# Altium schematic sheet [06]IN_OUT.SchDoc
size A4
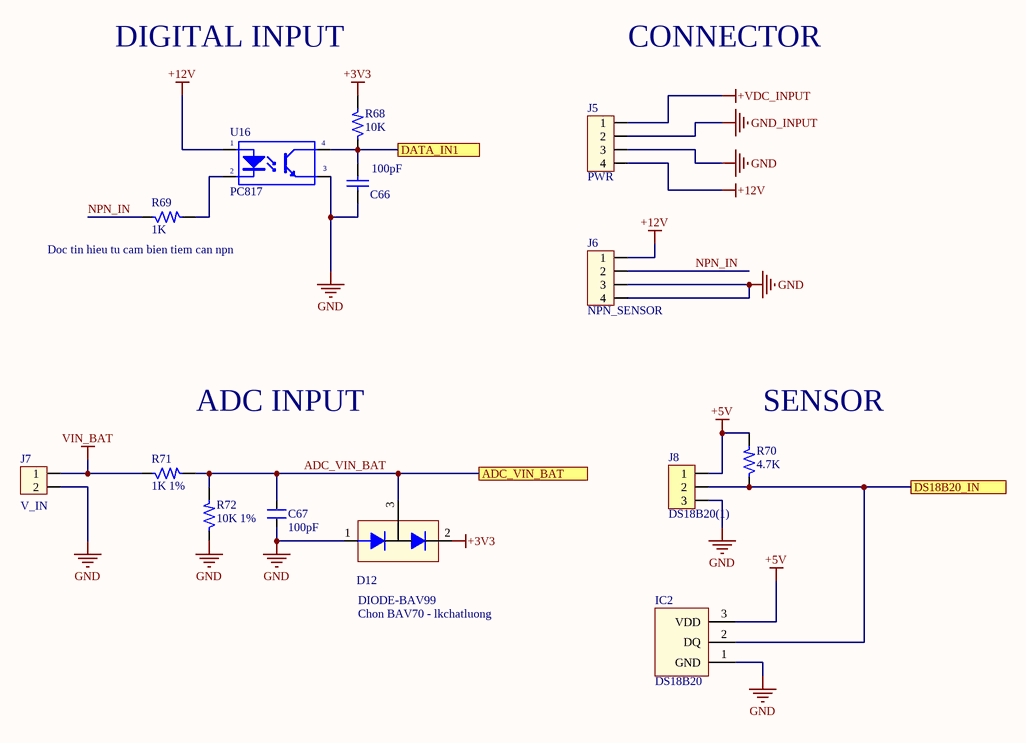
[diagram p0: [06]IN_OUT.SchDoc]

## Parts
C66  100pF  [CAP_0805]
C67  100pF  [CAP_0805]
D12  DIODE-BAV99  [SOT23]
IC2  DS18B20  [TO92]
J5  PWR  [Hed4V_3.96]
J6  NPN_SENSOR  [CON_2.54mm_4]
J7  V_IN  [CON_2.54mm_2]
J8  DS18B20(1)  [Header3]
R68  10K  [RES-SMD-0805]
R69  1K  [RES-SMD-0805]
R70  4.7K  [RES-SMD-0805]
R71  1K 1%  [RES-SMD-0805]
R72  10K 1%  [RES-SMD-0805]
U16  PC817  [PC817x1SMD]

## Ports
ADC_VIN_BAT, DATA_IN1, DS18B20_IN

## Nets
+3V3: D12.2 R68.2
+5V: IC2.3(VDD) J8.1 R70.2
+12V: J5.4 J6.1 U16.1(A)
+VDC_INPUT: J5.1
GND: C66.2 C67.1 D12.1 IC2.1(GND) J5.3 J6.3 J6.4 J7.2 J8.3 R72.1 U16.3(E)
GND_INPUT: J5.2
VIN_BAT: J7.1 R71.1
ADC_VIN_BAT: C67.2 D12.3 R71.2 R72.2 ; port ADC_VIN_BAT
DATA_IN1: C66.1 R68.1 U16.4(C) ; port DATA_IN1
DS18B20_IN: IC2.2(DQ) J8.2 R70.1 ; port DS18B20_IN
NPN_IN: J6.2 R69.1
NetR69_2: R69.2 U16.2(K)

## Notes on the sheet
- DIGITAL INPUT
- CONNECTOR
- (near R69) Doc tin hieu tu cam bien tiem can npn
- ADC INPUT
- (near R70) SENSOR
- Chon BAV70 - lkchatluong

## Library data of the parts
C66 = CapSMD: Capacitor; Value: 33p; Published: 8-Jun-2000; LatestRevisionDate: 17-Jul-2002; LatestRevisionNote: Re-released for DXP Platform.; PackageReference: RAD-0.3; Publisher: Altium Limited
C67 = CM: Cap SMD; Value: 103
D12 = DIODE-BAV99: ZENER, SOT23,; Manufacturer: ON Semiconductor / Fairchild; Manufacturer Part Number: BAV99; .Creator: LeKhaLinh; Other Drawings: Diode Circuit; PCN Design/Specification: Mold Compound 12/Dec/2007; PCN Assembly/Origin: SOT23 Manufacturing Source 31/May2013 / Assembly Site Addition 20/Jul/2015; PCN Packaging: Binary Year Code Marking 15/Jan/2014; Diode Configuration: 1 Pair Series Connection; Diode Type: Standard; Voltage - DC Reverse (Vr) (Max): 70V; Current - Average Rectified (Io) (per Diode): 200mA; Voltage - Forward (Vf) (Max) @ If: 1.25V @ 150mA; Speed: Small Signal =; Reverse Recovery Time (trr): 6ns; Current - Reverse Leakage @ Vr: 2.5µA @ 70V; Online Catalog: Diode Array; Other Names: BAV99FSDKR; .CheckPCB: LeKhaLinh; .CheckSCH: LeKhaLinh; Supplier 1: Digi-Key; Stock 1: 1165; Pricing 1: 1=0.26, 10=0.21, 100=0.1115, 500=0.0734, 1000=0.0499 (USD); Standard Package: 1; Category: Discrete Semiconductor Products; Family: Diodes, Rectifiers - Arrays; Packaging: Digi-Reel®; Mounting Type: Surface Mount; Package / Case: TO-236-3, SC-59, SOT-23-3; Supplier Device Package: SOT-23-3 (TO-236); ComponentLink1URL: https://www.fairchildsemi.com/package-drawings/MA/MA03B.pdf?src-supplier=Digi-Key; ComponentLink1Description: https://www.fairchildsemi.com/package-drawings/MA/MA03B.pdf?src-supplier=Digi-Key; ComponentLink2URL: http://www.farnell.com/datasheets/1822674.pdf?src-supplier=Element14; ComponentLink2Description: http://www.farnell.com/datasheets/1822674.pdf?src-supplier=Element14; ComponentLink3URL: http://www.mouser.com/ds/2/149/BAV99-22788.pdf?src-supplier=Mouser; ComponentLink3Description: http://www.mouser.com/ds/2/149/BAV99-22788.pdf?src-supplier=Mouser; ComponentLink4URL: http://www.fairchildsemi.com/ds/BA/BAV99.pdf?src-supplier=Avnet+Europe; ComponentLink4Description: http://www.fairchildsemi.com/ds/BA/BAV99.pdf?src-supplier=Avnet+Europe; ComponentLink5URL: https://www.verical.com/server-webapp/html/getDatasheet?partID=110217&src-supplier=Verical; ComponentLink5Description: https://www.verical.com/server-webapp/html/getDatasheet?partID=110217&src-supplier=Verical; ComponentLink6URL: http://www.farnell.com/datasheets/2304409.pdf?src-supplier=Element14; ComponentLink6Description: http://www.farnell.com/datasheets/2304409.pdf?src-supplier=Element14; Supplier 2: Mouser; Stock 2: 0; Supplier 3: Arrow; Stock 3: 5700; Pricing 3: 1=0.1933, 10=0.1873, 25=0.1555, 100=0.0806, 250=0.0724, 500=0.0523, 1000=0.0428, 3000=0.0342 (USD); Supplier Part Number 1: BAV99FSCT-ND; Supplier Part Number 2: 512-BAV99; Supplier Part Number 3: BAV99
IC2 = DS18S20: High Precision  1-Wire® Digital Thermometer
J5 = Hed4: Header 4 (Green); Value: Header 4
J6 = Con4: Connector 4; Value: Connector 4
J7 = Con2: Connector 2; Value: Connector 2
J8 = Header3: Header IDC, 3 x 1 Pin Vertical 2.54mm Pitch (Non-Boxed, Male); Manufacturer: W¨¹rth Elektronik eiSos GmbH; partNo: 613002143121; ComponentLink1 Description: Manufacturer; ComponentLink2 Description: Datasheet; NoPins: 02; Created Date: 29 March 2013; ComponentLink1URL: http://www.we-online.com; ComponentLink2URL: http://katalog.we-online.de/em/datasheet/6130xx143121.pdf; Created by: Karrer Zheng
R68 R70 R72 = RM: Resistor SMD; Value: 1K
R69 R71 = RM: Resistor SMD; Value: 1K
U16 = PC817: Single Opto; Value: PC817